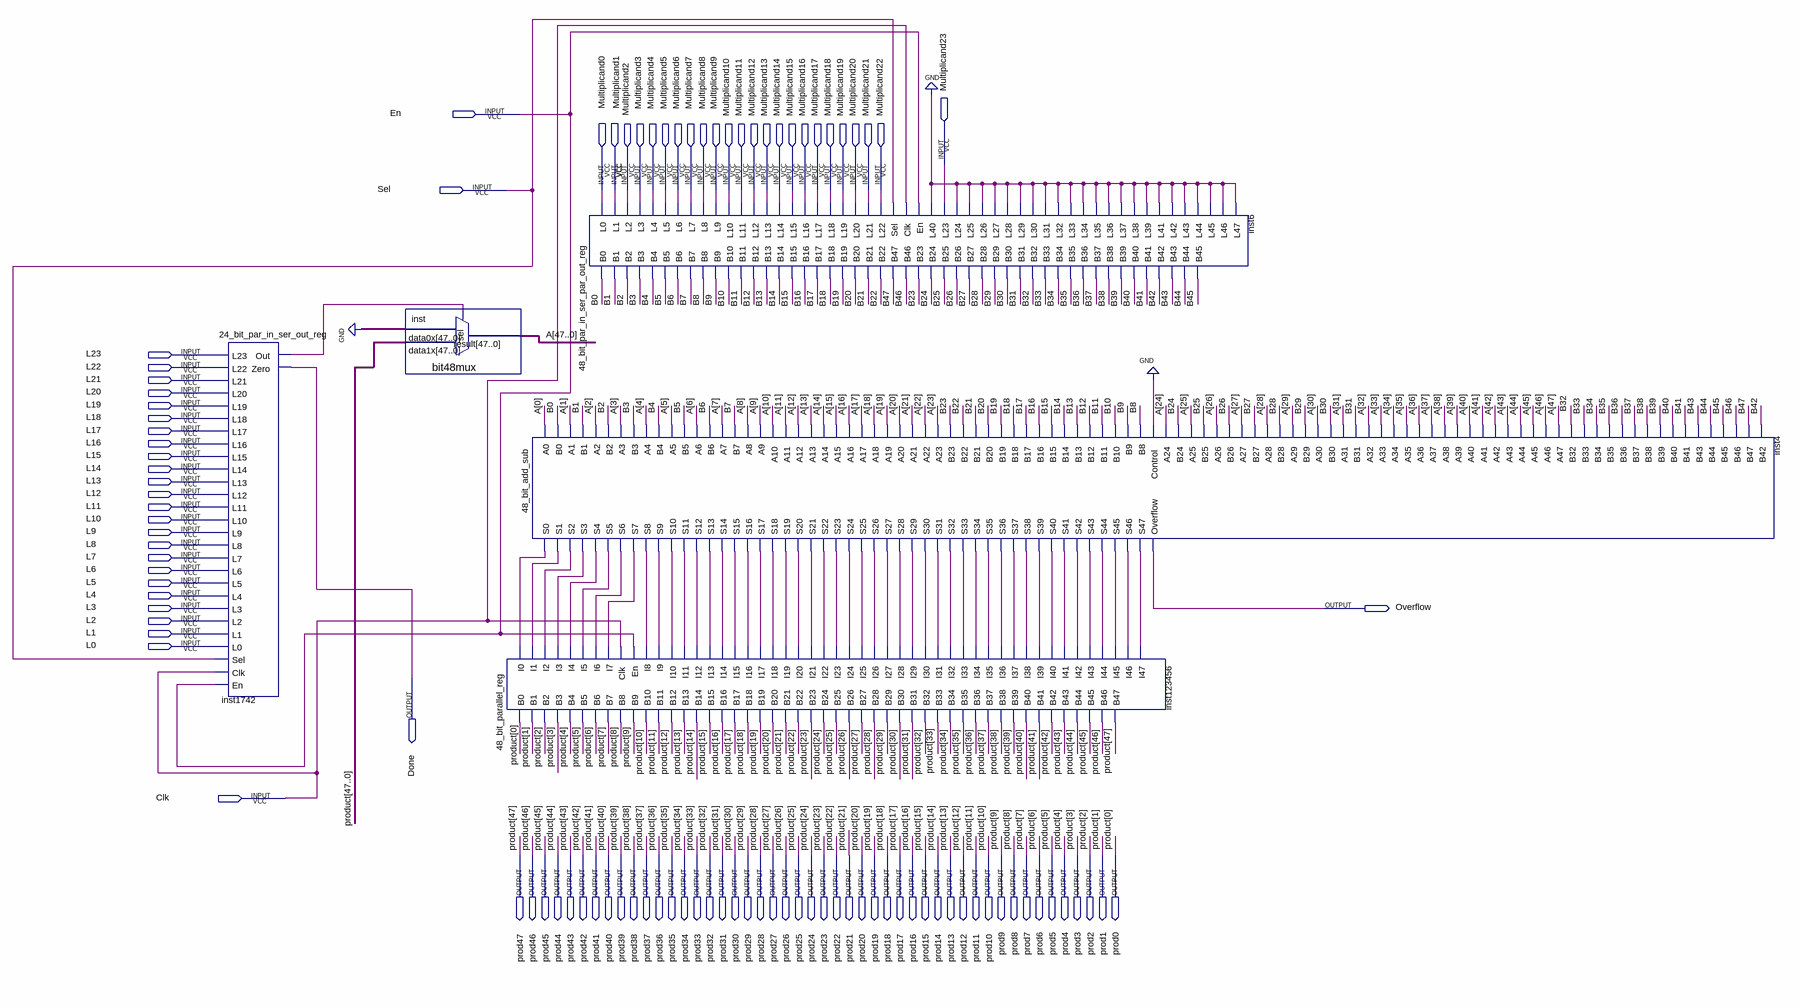
[diagram p0: schematic sheet]
// Quartus schematic Multiplier.bdf as structural Verilog: 5 symbols, 101 pins
module Multiplier (
  input  En,
  input  Multiplicand23,
  input  Sel,
  input  Multiplicand0,
  input  Multiplicand1,
  input  Multiplicand2,
  input  Multiplicand3,
  input  Multiplicand4,
  input  Multiplicand5,
  input  Multiplicand6,
  input  Multiplicand7,
  input  Multiplicand8,
  input  Multiplicand9,
  input  Multiplicand10,
  input  Multiplicand11,
  input  Multiplicand12,
  input  Multiplicand13,
  input  Multiplicand14,
  input  Multiplicand15,
  input  Multiplicand16,
  input  Multiplicand17,
  input  Multiplicand18,
  input  Multiplicand19,
  input  Multiplicand20,
  input  Multiplicand21,
  input  Multiplicand22,
  input  L23,
  input  L22,
  input  L21,
  input  L20,
  input  L19,
  input  L18,
  input  L17,
  input  L16,
  input  L15,
  input  L14,
  input  L13,
  input  L12,
  input  L11,
  input  L10,
  input  L9,
  input  L8,
  input  L7,
  input  L6,
  input  L5,
  input  L4,
  input  L3,
  input  L2,
  input  L1,
  input  L0,
  input  Clk,
  output Overflow,
  output Done,
  output prod47,
  output prod46,
  output prod45,
  output prod44,
  output prod43,
  output prod42,
  output prod41,
  output prod40,
  output prod39,
  output prod38,
  output prod37,
  output prod36,
  output prod35,
  output prod34,
  output prod33,
  output prod32,
  output prod31,
  output prod30,
  output prod29,
  output prod28,
  output prod27,
  output prod26,
  output prod25,
  output prod24,
  output prod23,
  output prod22,
  output prod21,
  output prod20,
  output prod19,
  output prod18,
  output prod17,
  output prod16,
  output prod15,
  output prod14,
  output prod13,
  output prod12,
  output prod11,
  output prod10,
  output prod9,
  output prod8,
  output prod7,
  output prod6,
  output prod5,
  output prod4,
  output prod3,
  output prod2,
  output prod1,
  output prod0
);

  wire B0, B1, B2, B3, B4, B5, B6, B7, B8, B9, B10, B11, B12, B13, B14, B15, B16, B17, B18, B19, B20, B21,
       B22, B23, B24, B25, B26, B27, B28, B29, B30, B31, B32, B33, B34, B35, B36, B37, B38, B39, B40, B41,
       B42, B43, B44, B45, B46, B47, inst4_s0, inst4_s1, inst4_s2, inst4_s3, inst4_s4, inst4_s5, inst4_s6,
       inst4_s7, inst4_s8, inst4_s9, inst4_s10, inst4_s11, inst4_s12, inst4_s13, inst4_s14, inst4_s15,
       inst4_s16, inst4_s17, inst4_s18, inst4_s19, inst4_s20, inst4_s21, inst4_s22, inst4_s23, inst4_s24,
       inst4_s25, inst4_s26, inst4_s27, inst4_s28, inst4_s29, inst4_s30, inst4_s31, inst4_s32, inst4_s33,
       inst4_s34, inst4_s35, inst4_s36, inst4_s37, inst4_s38, inst4_s39, inst4_s40, inst4_s41, inst4_s42,
       inst4_s43, inst4_s44, inst4_s45, inst4_s46, inst4_s47, inst1742_out;
  wire [47:0] A;

  \24_bit_par_in_ser_out_reg  inst1742 (
    .L23(L23), .L22(L22), .L21(L21), .L20(L20), .L19(L19), .L18(L18), .L17(L17), .L16(L16), .L15(L15),
    .L14(L14), .L13(L13), .L12(L12), .L11(L11), .L10(L10), .L9(L9), .L8(L8), .L7(L7), .L6(L6), .L5(L5),
    .L4(L4), .L3(L3), .L2(L2), .L1(L1), .L0(L0), .Sel(Sel), .Clk(Clk), .En(En), .Out(inst1742_out),
    .Zero(Done));
  bit48mux inst (
    .data1x({prod47, prod46, prod45, prod44, prod43, prod42, prod41, prod40, prod39, prod38, prod37, prod36, prod35, prod34, prod33, prod32, prod31, prod30, prod29, prod28, prod27, prod26, prod25, prod24, prod23, prod22, prod21, prod20, prod19, prod18, prod17, prod16, prod15, prod14, prod13, prod12, prod11, prod10, prod9, prod8, prod7, prod6, prod5, prod4, prod3, prod2, prod1, prod0}),
    .data0x({48{1'b0}}), .sel(inst1742_out), .result(A));
  \48_bit_add_sub  inst4 (
    .A0(A[0]), .B0(B0), .A1(A[1]), .B1(B1), .A2(A[2]), .B2(B2), .A3(A[3]), .B3(B3), .A4(A[4]), .B4(B4),
    .A5(A[5]), .B5(B5), .A6(A[6]), .B6(B6), .A7(A[7]), .B7(B7), .A8(A[8]), .A9(A[9]), .A10(A[10]),
    .A11(A[11]), .A12(A[12]), .A13(A[13]), .A14(A[14]), .A15(A[15]), .A16(A[16]), .A17(A[17]), .A18(A[18]),
    .A19(A[19]), .A20(A[20]), .A21(A[21]), .A22(A[22]), .A23(A[23]), .B23(B23), .B22(B22), .B21(B21),
    .B20(B20), .B19(B19), .B18(B18), .B17(B17), .B16(B16), .B15(B15), .B14(B14), .B13(B13), .B12(B12),
    .B11(B11), .B10(B10), .B9(B9), .B8(B8), .Control(1'b0), .A24(A[24]), .B24(B24), .A25(A[25]), .B25(B25),
    .A26(A[26]), .B26(B26), .A27(A[27]), .B27(B27), .A28(A[28]), .B28(B28), .A29(A[29]), .B29(B29),
    .A30(A[30]), .B30(B30), .A31(A[31]), .B31(B31), .A32(A[32]), .A33(A[33]), .A34(A[34]), .A35(A[35]),
    .A36(A[36]), .A37(A[37]), .A38(A[38]), .A39(A[39]), .A40(A[40]), .A41(A[41]), .A42(A[42]), .A43(A[43]),
    .A44(A[44]), .A45(A[45]), .A46(A[46]), .A47(A[47]), .B32(B32), .B33(B33), .B34(B34), .B35(B35),
    .B36(B36), .B37(B37), .B38(B38), .B39(B39), .B40(B40), .B41(B41), .B43(B43), .B44(B44), .B45(B45),
    .B46(B46), .B47(B47), .B42(B42), .S0(inst4_s0), .S1(inst4_s1), .S2(inst4_s2), .S3(inst4_s3),
    .S4(inst4_s4), .S5(inst4_s5), .S6(inst4_s6), .S7(inst4_s7), .S8(inst4_s8), .S9(inst4_s9),
    .S10(inst4_s10), .S11(inst4_s11), .S12(inst4_s12), .S13(inst4_s13), .S14(inst4_s14), .S15(inst4_s15),
    .S16(inst4_s16), .S17(inst4_s17), .S18(inst4_s18), .S19(inst4_s19), .S20(inst4_s20), .S21(inst4_s21),
    .S22(inst4_s22), .S23(inst4_s23), .S24(inst4_s24), .S25(inst4_s25), .S26(inst4_s26), .S27(inst4_s27),
    .S28(inst4_s28), .S29(inst4_s29), .S30(inst4_s30), .S31(inst4_s31), .S32(inst4_s32), .S33(inst4_s33),
    .S34(inst4_s34), .S35(inst4_s35), .S36(inst4_s36), .S37(inst4_s37), .S38(inst4_s38), .S39(inst4_s39),
    .S40(inst4_s40), .S41(inst4_s41), .S42(inst4_s42), .S43(inst4_s43), .S44(inst4_s44), .S45(inst4_s45),
    .S46(inst4_s46), .S47(inst4_s47), .Overflow(Overflow));
  \48_bit_parallel_reg  inst123456 (
    .I0(inst4_s0), .I1(inst4_s1), .I2(inst4_s2), .I3(inst4_s3), .I4(inst4_s4), .I5(inst4_s5), .I6(inst4_s6),
    .I7(inst4_s7), .Clk(Clk), .En(En), .I8(inst4_s8), .I9(inst4_s9), .I10(inst4_s10), .I11(inst4_s11),
    .I12(inst4_s12), .I13(inst4_s13), .I14(inst4_s14), .I15(inst4_s15), .I16(inst4_s16), .I17(inst4_s17),
    .I18(inst4_s18), .I19(inst4_s19), .I20(inst4_s20), .I21(inst4_s21), .I22(inst4_s22), .I23(inst4_s23),
    .I24(inst4_s24), .I25(inst4_s25), .I26(inst4_s26), .I27(inst4_s27), .I28(inst4_s28), .I29(inst4_s29),
    .I30(inst4_s30), .I31(inst4_s31), .I32(inst4_s32), .I33(inst4_s33), .I34(inst4_s34), .I35(inst4_s35),
    .I36(inst4_s36), .I37(inst4_s37), .I38(inst4_s38), .I39(inst4_s39), .I40(inst4_s40), .I41(inst4_s41),
    .I42(inst4_s42), .I43(inst4_s43), .I44(inst4_s44), .I45(inst4_s45), .I46(inst4_s46), .I47(inst4_s47),
    .B0(prod0), .B1(prod1), .B2(prod2), .B3(prod3), .B4(prod4), .B5(prod5), .B6(prod6), .B7(prod7),
    .B8(prod8), .B9(prod9), .B10(prod10), .B11(prod11), .B12(prod12), .B13(prod13), .B14(prod14),
    .B15(prod15), .B16(prod16), .B17(prod17), .B18(prod18), .B19(prod19), .B20(prod20), .B21(prod21),
    .B22(prod22), .B23(prod23), .B24(prod24), .B25(prod25), .B26(prod26), .B27(prod27), .B28(prod28),
    .B29(prod29), .B30(prod30), .B31(prod31), .B32(prod32), .B33(prod33), .B34(prod34), .B35(prod35),
    .B36(prod36), .B37(prod37), .B38(prod38), .B39(prod39), .B40(prod40), .B41(prod41), .B42(prod42),
    .B43(prod43), .B44(prod44), .B45(prod45), .B46(prod46), .B47(prod47));
  \48_bit_par_in_ser_par_out_reg  inst6 (
    .L0(Multiplicand0), .L1(Multiplicand1), .L2(Multiplicand2), .L3(Multiplicand3), .L4(Multiplicand4),
    .L5(Multiplicand5), .L6(Multiplicand6), .L7(Multiplicand7), .L8(Multiplicand8), .L9(Multiplicand9),
    .L10(Multiplicand10), .L11(Multiplicand11), .L12(Multiplicand12), .L13(Multiplicand13),
    .L14(Multiplicand14), .L15(Multiplicand15), .L16(Multiplicand16), .L17(Multiplicand17),
    .L18(Multiplicand18), .L19(Multiplicand19), .L20(Multiplicand20), .L21(Multiplicand21),
    .L22(Multiplicand22), .Sel(Sel), .Clk(Clk), .En(En), .L40(1'b0), .L23(Multiplicand23), .L24(1'b0),
    .L25(1'b0), .L26(1'b0), .L27(1'b0), .L28(1'b0), .L29(1'b0), .L30(1'b0), .L31(1'b0), .L32(1'b0),
    .L33(1'b0), .L34(1'b0), .L35(1'b0), .L36(1'b0), .L37(1'b0), .L38(1'b0), .L39(1'b0), .L41(1'b0),
    .L42(1'b0), .L43(1'b0), .L44(1'b0), .L45(1'b0), .L46(1'b0), .L47(1'b0), .B0(B0), .B1(B1), .B2(B2),
    .B3(B3), .B4(B4), .B5(B5), .B6(B6), .B7(B7), .B8(B8), .B9(B9), .B10(B10), .B11(B11), .B12(B12),
    .B13(B13), .B14(B14), .B15(B15), .B16(B16), .B17(B17), .B18(B18), .B19(B19), .B20(B20), .B21(B21),
    .B22(B22), .B47(B47), .B46(B46), .B23(B23), .B24(B24), .B25(B25), .B26(B26), .B27(B27), .B28(B28),
    .B29(B29), .B30(B30), .B31(B31), .B32(B32), .B33(B33), .B34(B34), .B35(B35), .B36(B36), .B37(B37),
    .B38(B38), .B39(B39), .B40(B40), .B41(B41), .B42(B42), .B43(B43), .B44(B44), .B45(B45));

  // Other names for the same wires on the sheet: product[47:0] = {prod47, prod46, prod45, prod44, prod43, prod42, prod41, prod40, prod39, prod38, prod37, prod36, prod35, prod34, prod33, prod32, prod31, prod30, prod29, prod28, prod27, prod26, prod25, prod24, prod23, prod22, prod21, prod20, prod19, prod18, prod17, prod16, prod15, prod14, prod13, prod12, prod11, prod10, prod9, prod8, prod7, prod6, prod5, prod4, prod3, prod2, prod1, prod0}
endmodule
